# EAGLE design teensy3.5dds (EAGLE 9.6.2)
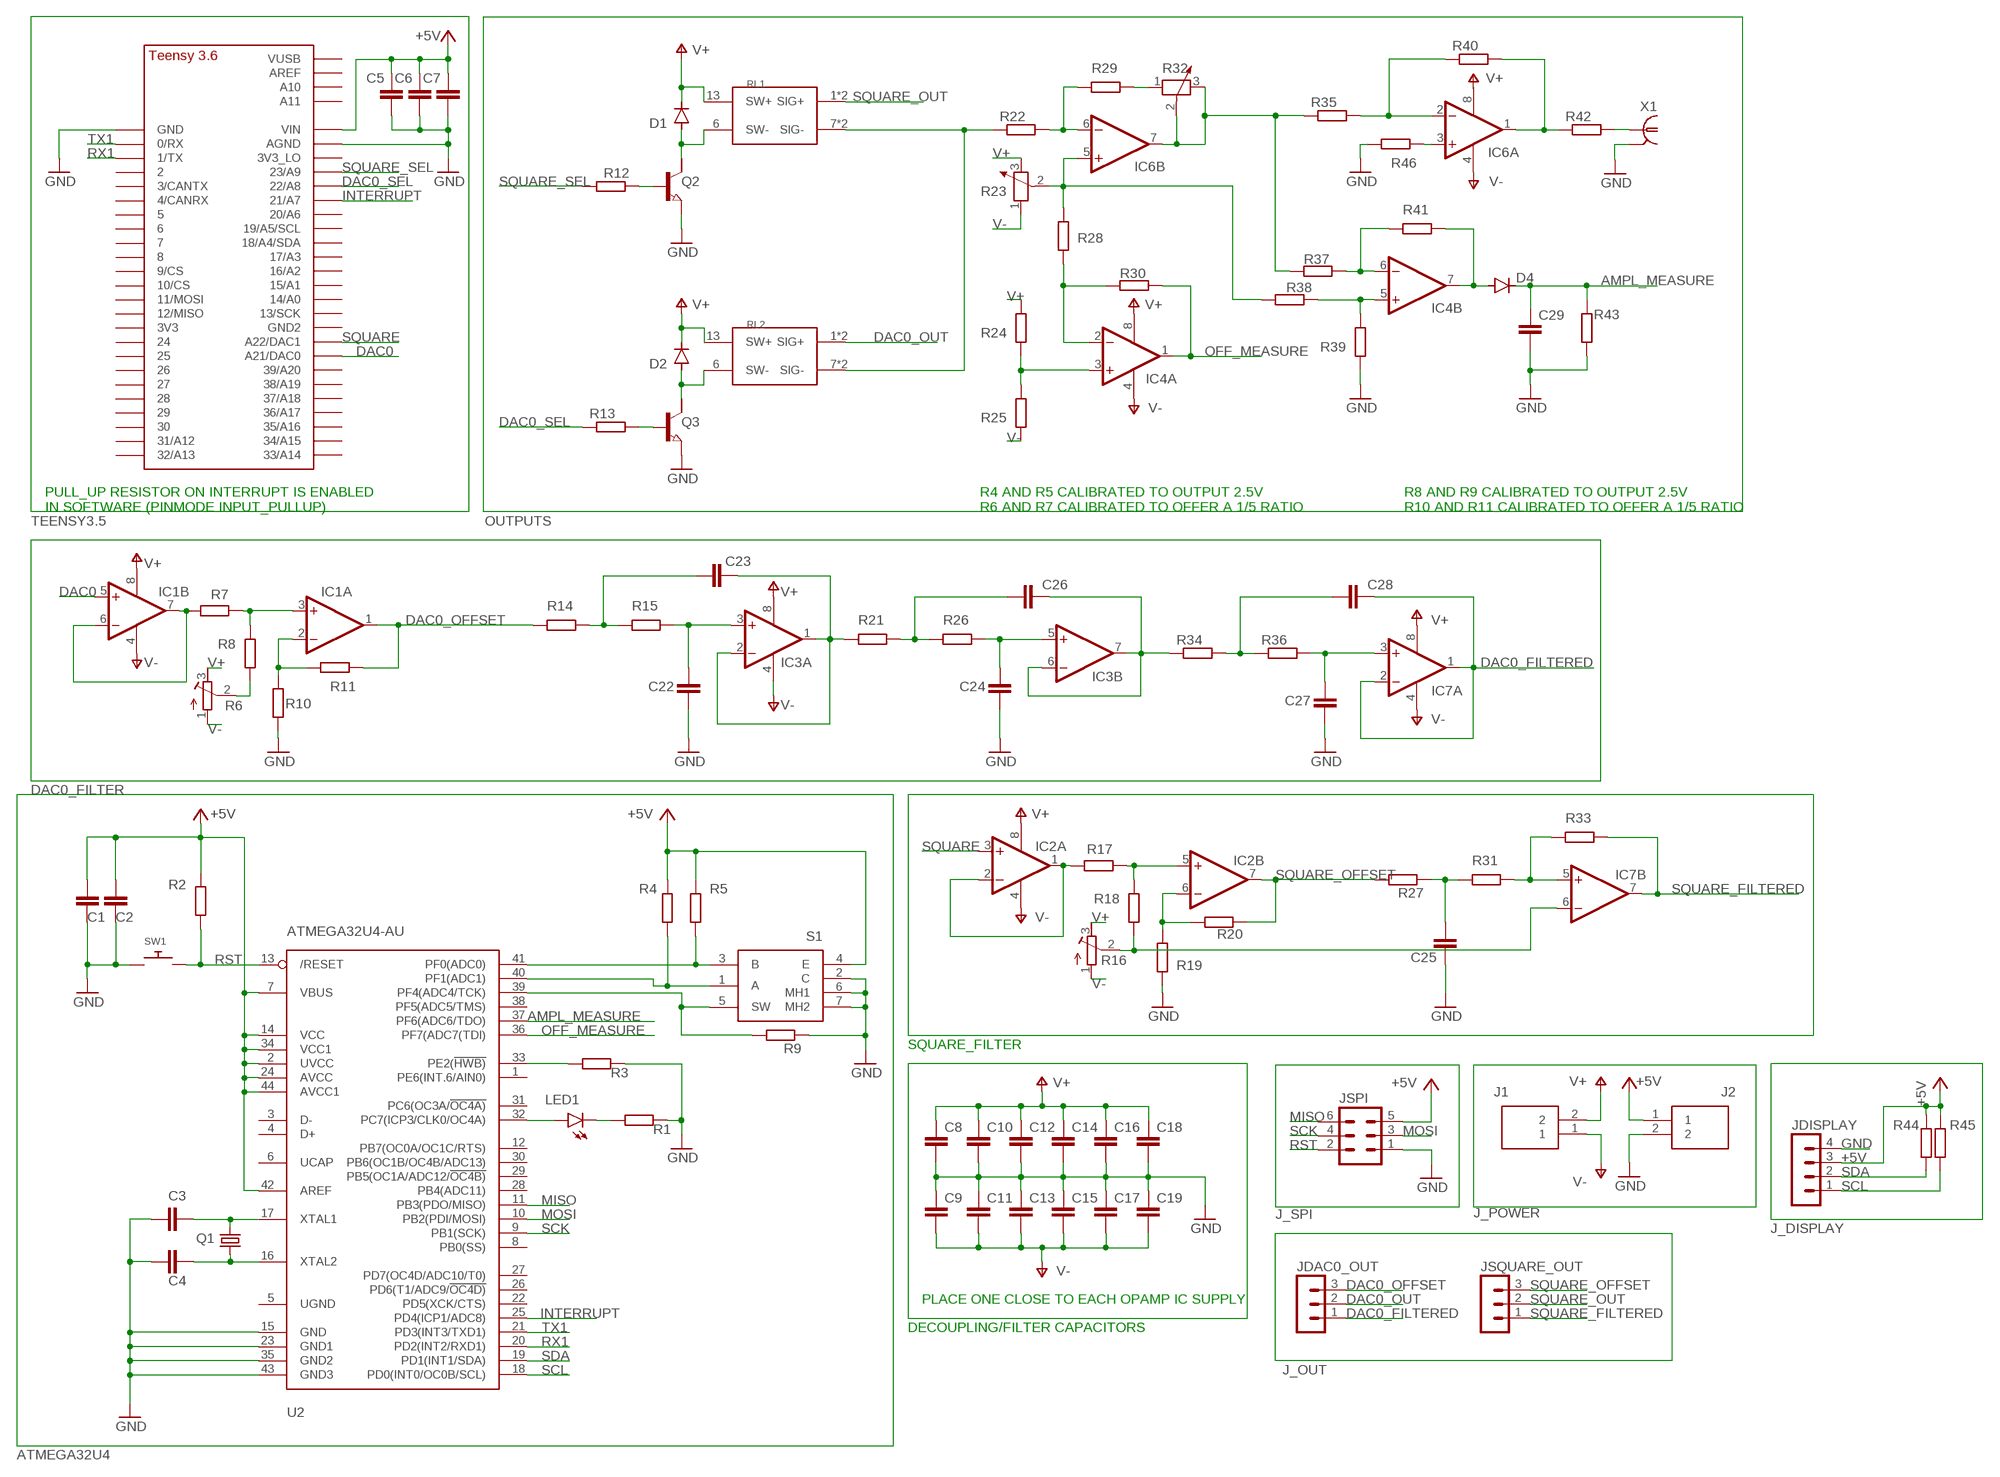
[diagram p0: schematic, sheet 1]

## Parts
C1  100u  C-EUC1206  [C1206]
C2  100n  C-EUC0805  [C0805]
C3  22p  C-EUC0805  [C0805]
C4  22p  C-EUC0805  [C0805]
C5  100u  C-EUC1206  [C1206]
C6  100n  C-EUC0805  [C0805]
C7  100n  C-EUC0805  [C0805]
C8  100n  C-EUC0805  [C0805]
C9  100n  C-EUC0805  [C0805]
C10  100n  C-EUC0805  [C0805]
C11  100n  C-EUC0805  [C0805]
C12  100n  C-EUC0805  [C0805]
C13  100n  C-EUC0805  [C0805]
C14  100n  C-EUC0805  [C0805]
C15  100n  C-EUC0805  [C0805]
C16  100n  C-EUC0805  [C0805]
C17  100n  C-EUC0805  [C0805]
C18  100n  C-EUC0805  [C0805]
C19  100n  C-EUC0805  [C0805]
C22  10p  C-EUC0805  [C0805]
C23  150p  C-EUC0805  [C0805]
C24  10p  C-EUC0805  [C0805]
C25  1p  C-EUC0805  [C0805]
C26  100p  C-EUC0805  [C0805]
C27  10p  C-EUC0805  [C0805]
C28  100p  C-EUC0805  [C0805]
C29  C-EUC0805  [C0805]
D1  DIODE-SOD323-W  [SOD323-W]
D2  DIODE-SOD323-W  [SOD323-W]
D4  DIODE-SOD123  [SOD123]
IC1  AD8034  TL082D  [SO08]
IC2  AD8034  TL082D  [SO08]
IC3  AD8034  TL082D  [SO08]
IC4  AD8034  TL082D  [SO08]
IC6  AD8034  TL082D  [SO08]
IC7  AD8034  TL082D  [SO08]
J1  1776275-2  [17762752]
J2  1776275-2  [17762752]
JDAC0_OUT  MA03-1  [MA03-1]
JDISPLAY  MA04-1  [MA04-1]
JSPI  MA03-2  [MA03-2]
JSQUARE_OUT  MA03-1  [MA03-1]
LED1  LEDCHIPLED_1206  [CHIPLED_1206]
Q1  16MHz  CSM-7X-DU  [CSM-7X-DU]
Q2  NPN-TRANSISTIOR-2COLSOT89  [SOT89]
Q3  NPN-TRANSISTIOR-2COLSOT89  [SOT89]
R1  220  R-EU_R0805  [R0805]
R2  10k  R-EU_R0805  [R0805]
R3  10k  R-EU_M0805  [M0805]
R4  10k  R-EU_R0805  [R0805]
R5  10k  R-EU_R0805  [R0805]
R6  100k  R-TRIMM3296W  [RTRIM3296W]
R7  1k  R-EU_R0805  [R0805]
R8  1k  R-EU_R0805  [R0805]
R9  10k  R-EU_R0805  [R0805]
R10  1k  R-EU_R0805  [R0805]
R11  1k  R-EU_R0805  [R0805]
R12  500  R-EU_R0805  [R0805]
R13  500  R-EU_R0805  [R0805]
R14  2.74k  R-EU_R0805  [R0805]
R15  2.74k  R-EU_R0805  [R0805]
R16  100k  R-TRIMM3296W  [RTRIM3296W]
R17  1k  R-EU_R0805  [R0805]
R18  1k  R-EU_R0805  [R0805]
R19  1k  R-EU_R0805  [R0805]
R20  1k  R-EU_R0805  [R0805]
R21  787  R-EU_R0805  [R0805]
R22  1k  R-EU_R0805  [R0805]
R23  10k  POTENTIOMETER_VERTICAL  [MA03-1]
R24  1k  R-EU_R0805  [R0805]
R25  1.5k  R-EU_R0805  [R0805]
R26  14.3k  R-EU_R0805  [R0805]
R27  50  R-EU_R0805  [R0805]
R28  5k  R-EU_R0805  [R0805]
R29  100  R-EU_R0805  [R0805]
R30  1k  R-EU_R0805  [R0805]
R31  2k  R-EU_R0805  [R0805]
R32  10k  POTENTIOMETER_VERTICAL  [MA03-1]
R33  10k  R-EU_R0805  [R0805]
R34  562  R-EU_R0805  [R0805]
R35  R-EU_R0805  [R0805]
R36  20k  R-EU_R0805  [R0805]
R37  5k  R-EU_R0805  [R0805]
R38  10k  R-EU_R0805  [R0805]
R39  14.3k  R-EU_R0805  [R0805]
R40  R-EU_R0805  [R0805]
R41  1k  R-EU_R0805  [R0805]
R42  50  R-EU_R0805  [R0805]
R43  R-EU_R0805  [R0805]
R44  R-EU_R0805  [R0805]
R45  R-EU_R0805  [R0805]
R46  R-EU_R0805  [R0805]
RL1  PRME_15005NOSOCKET  [DIL14]
RL2  PRME_15005NOSOCKET  [DIL14]
S1  EC11B15242AE  [EC11B15242AE]
SW1  SWITCH_PUSHBUTTONC&K_KSS  [BTN_CK_KSS]
U1  TEENSY_3.5/3.6_BASIC  [TEENSY_3.5/3.6_BASIC]
U2  ATMEGA32U4-AU  [TQFP44]
X1  1-227161-0  [AMP_227161]

## Nets
+5V [supply]: C1.1 C2.1 C5.1 C6.1 C7.1 J2.1 JDISPLAY.3 JSPI.5 R2.2 R4.1 R5.1 R44.2 R45.1 S1.4(E) U1.VIN U2.2(UVCC) U2.7(VBUS) U2.14(VCC) U2.24(AVCC) U2.34(VCC1) U2.42(AREF) U2.44(AVCC1)
AMPL_MEASURE [signal]: C29.1 D4.C R43.2 U2.37(PF6(ADC6/TDO))
DAC0 [signal]: IC1.5(B:+IN) U1.21/DAC0(A21/DAC0)
DAC0_FILTERED [signal]: C28.1 IC7.1(A:OUT) IC7.2(A:-IN) JDAC0_OUT.1
DAC0_OFFSET [signal]: IC1.1(A:OUT) JDAC0_OUT.3 R11.1 R14.1
DAC0_OUT [signal]: JDAC0_OUT.2 RL2.1(SIG+) RL2.14(SIG+)
DAC0_SEL [signal]: R13.1 U1.22/A8
GND [supply]: C1.2 C2.2 C3.1 C4.1 C5.2 C6.2 C7.2 C8.2 C9.1 C10.2 C11.1 C12.2 C13.1 C14.2 C15.1 C16.2 C17.1 C18.2 C19.1 C22.1 C24.1 C25.1 C27.1 C29.2 J2.2 JDISPLAY.4 JSPI.1 Q2.3(E) Q3.3(E) R1.1 R3.2 R9.1 R10.2 R19.2 R39.2 R43.1 R46.1 S1.2(C) S1.6(MH1) S1.7(MH2) SW1.P$1 U1.AGND U1.GND U2.15(GND) U2.23(GND1) U2.35(GND2) U2.43(GND3) X1.2
INTERRUPT [signal]: U1.21/A7 U2.25(PD4(ICP1/ADC8))
MISO [signal]: JSPI.6 U2.11(PB3(PDO/MISO))
MOSI [signal]: JSPI.3 U2.10(PB2(PDI/MOSI))
N$1 [signal]: IC7.5(B:+IN) R31.2 R33.1
N$2 [signal]: D1.A Q2.2(C) RL1.6(SW-)
N$3 [signal]: IC6.5(B:+IN) R23.2 R28.1 R38.1
N$4 [signal]: C4.2 Q1.1 U2.16(XTAL2)
N$5 [signal]: IC6.6(B:-IN) R22.2 R29.1
N$6 [signal]: R42.2 X1.1
N$8 [signal]: R5.2 S1.3(B) U2.41(PF0(ADC0))
N$9 [signal]: IC6.7(B:OUT) R32.2 R32.3 R35.1 R37.1
N$10 [signal]: R22.1 RL1.7(SIG-) RL1.8(SIG-) RL2.7(SIG-) RL2.8(SIG-)
N$11 [signal]: IC4.2(A:-IN) R28.2 R30.2
N$12 [signal]: D2.A Q3.2(C) RL2.6(SW-)
N$13 [signal]: IC4.3(A:+IN) R24.1 R25.2
N$14 [signal]: IC4.5(B:+IN) R38.2 R39.1
N$15 [signal]: R29.2 R32.1
N$16 [signal]: IC4.6(B:-IN) R37.2 R41.1
N$17 [signal]: Q2.1(B) R12.2
N$18 [signal]: Q3.1(B) R13.2
N$19 [signal]: IC6.1(A:OUT) R40.2 R42.1
N$20 [signal]: D4.A IC4.7(B:OUT) R41.2
N$21 [signal]: IC1.2(A:-IN) R10.1 R11.2
N$22 [signal]: IC6.3(A:+IN) R46.2
N$23 [signal]: IC1.6(B:-IN) IC1.7(B:OUT) R7.1
N$24 [signal]: IC2.6(B:-IN) R19.1 R20.2
N$25 [signal]: R4.2 S1.1(A) U2.40(PF1(ADC1))
N$26 [signal]: IC1.3(A:+IN) R7.2 R8.2
N$27 [signal]: IC2.1(A:OUT) IC2.2(A:-IN) R17.1
N$28 [signal]: IC2.5(B:+IN) R17.2 R18.2
N$29 [signal]: R9.2 S1.5(SW) U2.39(PF4(ADC4/TCK))
N$30: LED1.A U2.32(PC7(ICP3/CLK0/OC4A))
N$31 [signal]: C3.2 Q1.2 U2.17(XTAL1)
N$32 [signal]: R3.1 U2.33(PE2(!HWB))
N$34 [signal]: C25.2 R27.1 R31.1
N$36 [signal]: IC6.2(A:-IN) R35.2 R40.1
N$37 [signal]: IC7.6(B:-IN) R16.2(S) R18.1
N$38 [signal]: LED1.C R1.2
N$50 [signal]: C23.2 R14.2 R15.1
N$53 [signal]: C23.1 IC3.1(A:OUT) IC3.2(A:-IN) R21.1
N$56 [signal]: R6.2(S) R8.1
N$58 [signal]: C22.2 IC3.3(A:+IN) R15.2
N$61 [signal]: C26.1 R21.2 R26.1
N$62 [signal]: C26.2 IC3.6(B:-IN) IC3.7(B:OUT) R34.1
N$63 [signal]: C24.2 IC3.5(B:+IN) R26.2
N$73 [signal]: C28.2 R34.2 R36.1
N$75 [signal]: C27.2 IC7.3(A:+IN) R36.2
OFF_MEASURE [signal]: IC4.1(A:OUT) R30.1 U2.36(PF7(ADC7(TDI))
RST [signal]: JSPI.2 R2.1 SW1.P$2 U2.13(/RESET)
RX1 [signal]: U1.1/TX U2.20(PD2(INT2/RXD1))
SCK [signal]: JSPI.4 U2.9(PB1(SCK))
SCL [signal]: JDISPLAY.1 R45.2 U2.18(PD0(INT0/OC0B/SCL))
SDA [signal]: JDISPLAY.2 R44.1 U2.19(PD1(INT1/SDA))
SQUARE [signal]: IC2.3(A:+IN) U1.A22/DAC1
SQUARE_FILTERED [signal]: IC7.7(B:OUT) JSQUARE_OUT.1 R33.2
SQUARE_OFFSET [signal]: IC2.7(B:OUT) JSQUARE_OUT.3 R20.1 R27.2
SQUARE_OUT [signal]: JSQUARE_OUT.2 RL1.1(SIG+) RL1.14(SIG+)
SQUARE_SEL [signal]: R12.1 U1.23/A9
TX1 [signal]: U1.0/RX U2.21(PD3(INT3/TXD1))
V+ [supply]: C8.1 C10.1 C12.1 C14.1 C16.1 C18.1 D1.C D2.C IC1.8(P:V+) IC2.8(P:V+) IC3.8(P:V+) IC4.8(P:V+) IC6.8(P:V+) IC7.8(P:V+) J1.2 R6.3(E) R16.3(E) R23.3 R24.2 RL1.13(SW+) RL2.13(SW+)
V- [supply]: C9.2 C11.2 C13.2 C15.2 C17.2 C19.2 IC1.4(P:V-) IC2.4(P:V-) IC3.4(P:V-) IC4.4(P:V-) IC6.4(P:V-) IC7.4(P:V-) J1.1 R6.1(A) R16.1(A) R23.1 R25.1
Unconnected: Q2.2@1(C/) Q3.2@1(C/) U1.2 U1.3/CANTX U1.3V3 U1.3V3_LO U1.4/CANRX U1.5 U1.6 U1.7 U1.8 U1.9/CS U1.10/CS U1.11/MOSI U1.12/MISO U1.13/SCK U1.14/A0 U1.15/A1 U1.16/A2 U1.17/A3 U1.18/A4/SDA U1.19/A5/SCL U1.20/A6 U1.24 U1.25 U1.26 U1.27 U1.28 U1.29 U1.30 U1.31/A12 U1.32/A13 U1.33/A14 U1.34/A15 U1.35/A16 U1.36/A17 U1.37/A18 U1.38/A19 U1.39/A20 U1.A10 U1.A11 U1.AREF U1.GND2 U1.VUSB U2.1(PE6(INT.6/AIN0)) U2.3(D-) U2.4(D+) U2.5(UGND) U2.6(UCAP) U2.8(PB0(SS)) U2.12(PB7(OC0A/OC1C/RTS)) U2.22(PD5(XCK/CTS)) U2.26(PD6(T1/ADC9/!OC4D)) U2.27(PD7(OC4D/ADC10/T0)) U2.28(PB4(ADC11)) U2.29(PB5(OC1A/ADC12/!OC4B)) U2.30(PB6(OC1B/OC4B/ADC13)) U2.31(PC6(OC3A/!OC4A)) U2.38(PF5(ADC5/TMS))

## Notes on the sheet
- PULL_UP RESISTOR ON INTERRUPT IS ENABLED
  IN SOFTWARE (PINMODE INPUT_PULLUP)
- R4 AND R5 CALIBRATED TO OUTPUT 2.5V
  R6 AND R7 CALIBRATED TO OFFER A 1/5 RATIO
- R8 AND R9 CALIBRATED TO OUTPUT 2.5V
  R10 AND R11 CALIBRATED TO OFFER A 1/5 RATIO
- SQUARE_FILTER
- PLACE ONE CLOSE TO EACH OPAMP IC SUPPLY
- DECOUPLING/FILTER CAPACITORS

## Library data of the parts
C1-C19 C22-C29 = rcl:C-EU: CAPACITOR, European symbol; SPICEPREFIX: C
D1 D2 D4 = diode:DIODE-: DIODE
IC1-IC4 IC6 IC7 = linear:TL082: OP AMP Data sheet <http://www.ti.com/lit/ds/symlink/tl084a . pdf>; DATA_SHEET: <a href="http://www.ti.com/lit/ds/symlink/tl084a.pdf"> Data sheet </a>
J1 J2 = 1776275-2:1776275-2: Fixed Terminal Blocks 2 POS SIDE ENT 3.5MM Source: Datasheet <https://www.mouser.co.uk/ProductDetail/TE-Connectivity-AMP/1776275-2/?qs=/ha2pyFaduh5oRLpYFqVQ2CuT224sRAAEtPMkKhfNDU=>; DESCRIPTION: Fixed Terminal Blocks 2 POS SIDE ENT 3.5MM; HEIGHT: 8.6mm; MANUFACTURER_NAME: TE Connectivity; MANUFACTURER_PART_NUMBER: 1776275-2
JDAC0_OUT JSQUARE_OUT = con-lstb:MA03-1: PIN HEADER; OC_FARNELL: unknown; OC_NEWARK: unknown
JDISPLAY = con-lstb:MA04-1: PIN HEADER; OC_FARNELL: unknown; OC_NEWARK: unknown
JSPI = con-lstb:MA03-2: PIN HEADER; OC_FARNELL: unknown; OC_NEWARK: unknown
LED1 = led:LED: LED OSRAM: - CHIPLED LG R971, LG N971, LY N971, LG Q971, LY Q971, LO R971, LY R971 LH N974, LH R974 LS Q976, LO Q976, LY Q976 LO Q996 - Hyper CHIPLED LW Q18S LB Q993, LB Q99A, LB R99A - SideLED LS A670, LO A670, LY A670, LG A670, LP A670 LB A673, LV A673, LT A673, LW A673 LH A674 LY A675 LS A676, LA A676, LO A676, LY A676, LW A676 LS A679, LY A679, LG A679 - Hyper Micro SIDELED® LS Y876, LA Y876, LO Y876, LY Y876 LT Y87S - SmartLED LW L88C, LW L88S LB L89C, LB L89S, LG L890 LS L89K, LO L89K, LY L89K LS L896, LA L896, LO L896, LY L896 - TOPLED LS T670, LO T670, LY T670, LG T670, LP T670 LSG T670, LSP T670, LSY T670, LOP T670, LYG T670 LG T671, LOG T671, LSG T671 LB T673, LV T673, LT T673, LW T673 LH T674 LS T676, LA T676, LO T676, LY T676, LB T676, LH T676, LSB T676, LW T676 LB T67C, LV T67C, LT T67C, LS T67K, LO T67K, LY T67K, LW E67C LS E67B, LA E67B, LO E67B, LY E67B, LB E67C, LV E67C, LT E67C LW T67C LS T679, LY T679, LG T679 LS T770, LO T770, LY T770, LG T770, LP T770 LB T773, LV T773, LT T773, LW T773 LH T774 LS E675, LA E675, LY E675, LS T675 LS T776, LA T776, LO T776, LY T776, LB T776 LHGB T686 LT T68C, LB T68C - Hyper Mini TOPLED® LB M676 - Mini TOPLED Santana® LG M470 LS M47K, LO M47K, LY M47K Source: http://www.osram.convergy.de LUXEON: - LUMILED® LXK2-PW12-R00, LXK2-PW12-S00, LXK2-PW14-U00, LXK2-PW14-V00 LXK2-PM12-R00, LXK2-PM12-S00, LXK2-PM14-U00 LXK2-PE12-Q00, LXK2-PE12-R00, LXK2-PE12-S00, LXK2-PE14-T00, LXK2-PE14-U00 LXK2-PB12-K00, LXK2-PB12-L00, LXK2-PB12-M00, LXK2-PB14-N00, LXK2-PB14-P00, LXK2-PB14-Q00 LXK2-PR12-L00, LXK2-PR12-M00, LXK2-PR14-Q00, LXK2-PR14-R00 LXK2-PD12-Q00, LXK2-PD12-R00, LXK2-PD12-S00 LXK2-PH12-R00, LXK2-PH12-S00 LXK2-PL12-P00, LXK2-PL12-Q00, LXK2-PL12-R00 Source: www.luxeon.com KINGBRIGHT: KA-3528ASYC Source: www.kingbright.com
Q1 = crystal:CSM-7X-DU: SMD CRYSTAL Source: www.ecsxtal.com .. Crystal 3.6864MHz CSM_7X_DU.PDF; OC_FARNELL: unknown; OC_NEWARK: unknown
Q2 Q3 = semicon-smd-ipc:NPN-TRANSISTIOR-2COL: NPN TRANSISTOR 2 colletor pins
R1-R5 R7-R15 R17-R22 R24-R31 R33-R46 = rcl:R-EU_: RESISTOR, European symbol; SPICEPREFIX: R
R6 R16 = rcl:R-TRIMM: Trimm resistor; SPICEMODEL: X; SPICEPREFIXL: POT
R23 R32 = Potentiometer_vertical:POTENTIOMETER_VERTICAL
RL1 RL2 = prme15005:PRME_15005
S1 = EC11B15242AE:EC11B15242AE: 20mm Horizontal encoder 15 Pulses 30 DET Source: Datasheet <https://www.alps.com/prod/info/E/HTML/Encoder/Incremental/EC11/EC11B15242AE.html#Dimensions>; DESCRIPTION: 20mm Horizontal encoder 15 Pulses 30 DET; HEIGHT: 13mm; MANUFACTURER_NAME: ALPS; MANUFACTURER_PART_NUMBER: EC11B15242AE; MOUSER_PART_NUMBER: 688-EC11B15242AE; MOUSER_PRICE-STOCK: http://www.mouser.com/Search/ProductDetail.aspx?qs=PoKhxlfUXjIm2pRMScFQOQ%3d%3d
SW1 = adafruit:SWITCH_PUSHBUTTON: Buttons SOFTTOUCHSMD_SJ - Soft touch temporary push button (Super Junk Akihabara) Compatible with SKPMANE010 [Mouser: 688-SKPMAN] C&K_KSS = Digikey: KSS221GLFS
U1 = Teensy356:TEENSY_3.5/3.6_BASIC
U2 = adafruit:ATMEGA32U4: http://www.ladyada.net/library/eagle
X1 = con-coax:?227161*: JACK, RIGHT ANGLE, 50 OHM, PCB, BNC Source: amp_227161.pdf; MF: TYCO ELECTRONICS; MPN: 1-227161; OC_FARNELL: unknown; OC_NEWARK: 33B3200

## Net classes
0 default: width 0.254 mm
1 signal: width 0.254 mm
2 supply: width 0.381 mm

## Board
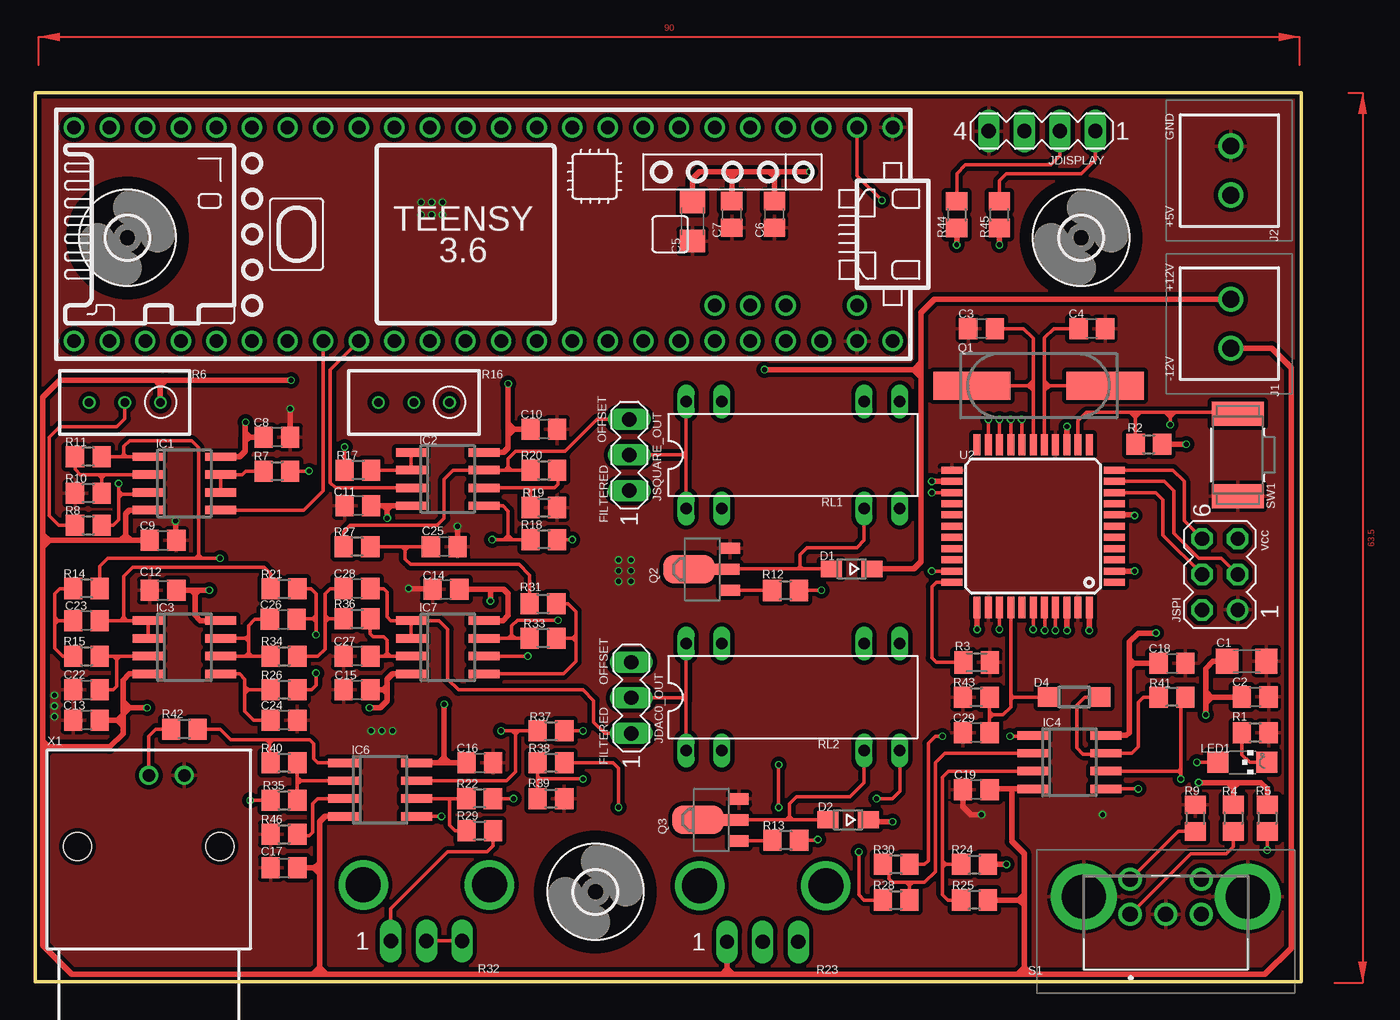
[diagram p1: board, top side]
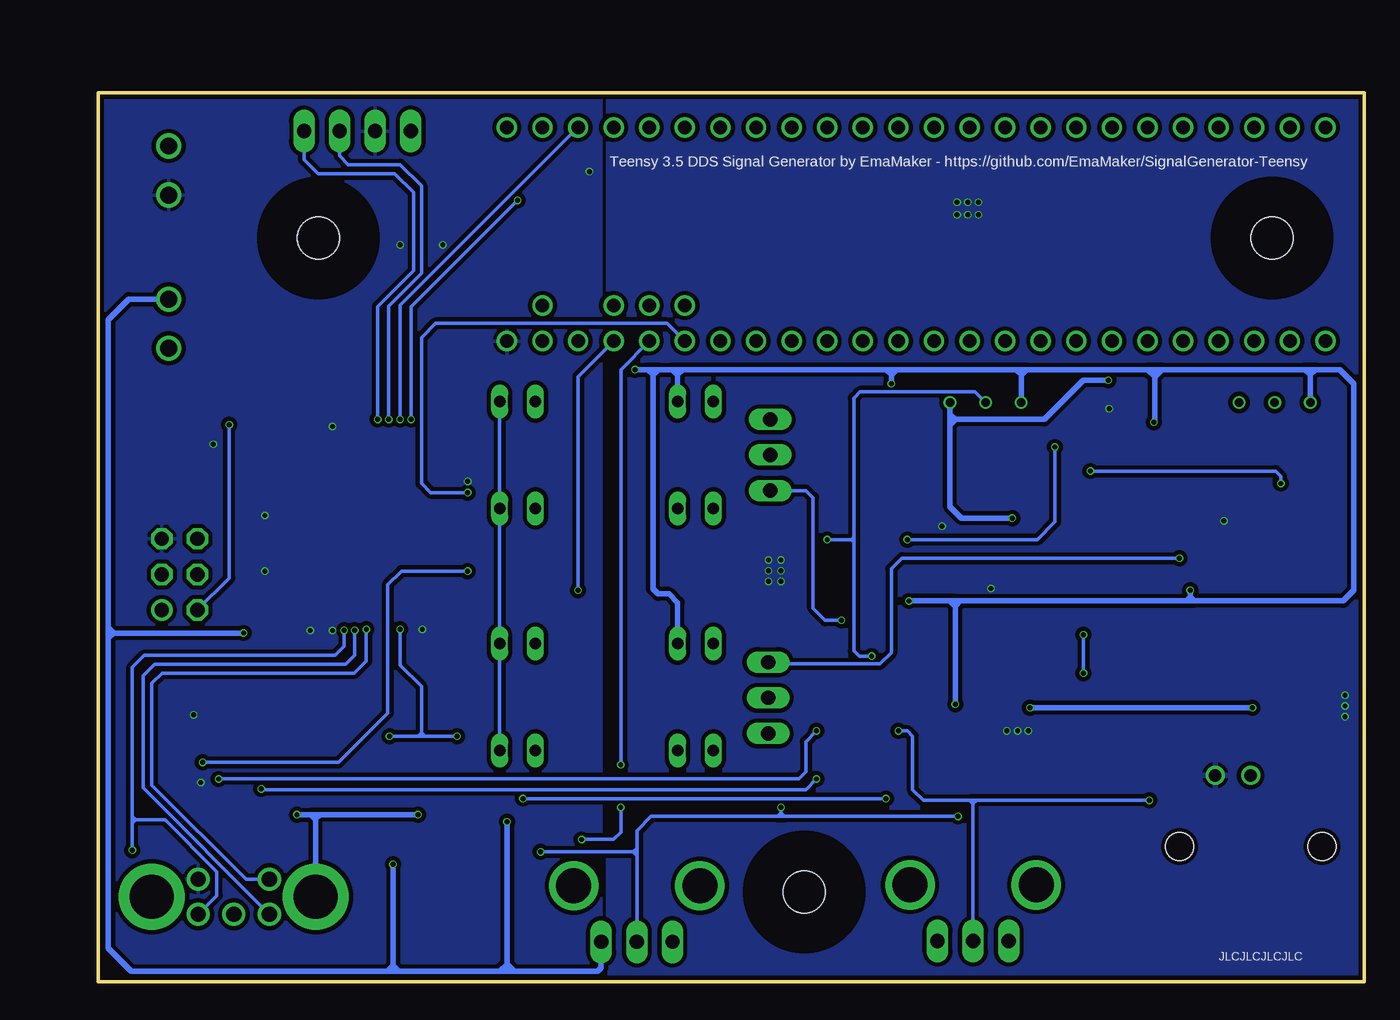
[diagram p2: board, bottom side, seen from below]

Size 90.38 x 63.42 mm. Coordinates in mm from the lower left corner, seen from the top.
Outline: 0,0 90.38,0 90.38,63.42 0,63.42 0,0
Copper layers (1*16): Top 0.035559375mm / dielectric 1.6mm / Bottom 0.035559375mm
Design rules "jlcpcb2layer": minimum track width 5mil, minimum drill 12mil, track to track 5mil, track to pad 5mil, pad to pad 5mil, via to via 5mil, smd to smd 5mil, copper to edge 8mil, drill to drill 6mil, minimum pad ring 5mil, minimum via ring 3mil, stop-mask expansion 2.5mil, vias tented up to drill 0mil, thermal gap 10mil

### Footprints (pad centres in the part's own frame; a part is rotated, then mirrored left to right if it is on the bottom)
C1206 = smd 1.6 x 1.8: 1 -1.4,0; 2 1.4,0
C0805 = smd 1.3 x 1.5: 1 -0.95,0; 2 0.95,0
SOD323-W = smd 1.5 x 1.2: A 1.45,0; C -1.45,0
SOD123 = smd 1.4 x 1.4: A 1.9,0; C -1.9,0
SO08 = smd 0.6 x 2.2: 1 -1.905,-2.6; 2 -0.635,-2.6; 3 0.635,-2.6; 4 1.905,-2.6; 5 1.905,2.6; 6 0.635,2.6; 7 -0.635,2.6; 8 -1.905,2.6
17762752 = drill 1.2 pad 1.8: 1 0,0; 2 3.5,0
MA03-1 = drill 1.016 long: 1 -2.54,0; 2 0,0; 3 2.54,0
MA04-1 = drill 1.016 long: 1 -3.81,0; 2 -1.27,0; 3 1.27,0; 4 3.81,0
MA03-2 = drill 1.016: 1 -2.54,-1.27 | drill 1.016 octagon: 2 -2.54,1.27; 3 0,-1.27; 4 0,1.27; 5 2.54,-1.27; 6 2.54,1.27
CHIPLED_1206 = smd 1.5 x 1.5: A 0,-1.75; C 0,1.75
CSM-7X-DU = smd 5.5 x 2: 1 -4.75,0; 2 4.75,0
SOT89 = smd 0.8 x 1.4: 1 -1.499,-1.981; 3 1.499,-1.981 | smd 0.8 x 1.9: 2 0,-1.727 | smd 2.032 x 3.65: 2@1 0,0.94
R0805 = smd 1.3 x 1.5: 1 -0.95,0; 2 0.95,0
M0805 = smd 1.3 x 1.6: 1 -0.95,0; 2 0.95,0
RTRIM3296W = drill 0.61: 1 0,-2.54; 2 0,0; 3 0,2.54
MA03-1' = drill 1.016 long: 1 -2.54,0; 2 0,0; 3 2.54,0 | drill 2.5 pad 3: P$1 4.5,4; P$2 -4.5,4
DIL14 = drill 0.813 long: 1 -7.62,-3.81; 2 -5.08,-3.81; 6 5.08,-3.81; 7 7.62,-3.81; 8 7.62,3.81; 9 5.08,3.81; 13 -5.08,3.81; 14 -7.62,3.81
EC11B15242AE = drill 1.1 pad 1.65: 1 -0.95,-2.54; 2 -0.95,0; 3 -0.95,2.54; 4 -3.45,2.54; 5 -3.45,-2.54 | drill 3.14 pad 4.71: 6 -2.2,5.85; 7 -2.2,-5.85
BTN_CK_KSS = smd 1.7 x 3.7: P$1 -2.95,0; P$2 2.95,0
TEENSY_3.5/3.6_BASIC = drill 0.965: 0/RX -25.4,-7.62; 1/TX -22.86,-7.62; 2 -20.32,-7.62; 3/CANTX -17.78,-7.62; 3V3 7.62,-7.62; 3V3_LO -22.86,7.62; 4/CANRX -15.24,-7.62; 5 -12.7,-7.62; 6 -10.16,-7.62; 7 -7.62,-7.62; 8 -5.08,-7.62; 9/CS -2.54,-7.62; 10/CS 0,-7.62; 11/MOSI 2.54,-7.62; 12/MISO 5.08,-7.62; 13/SCK 5.08,7.62; 14/A0 2.54,7.62; 15/A1 0,7.62; 16/A2 -2.54,7.62; 17/A3 -5.08,7.62; 18/A4/SDA -7.62,7.62; 19/A5/SCL -10.16,7.62; 20/A6 -12.7,7.62; 21/A7 -15.24,7.62; 21/DAC0 12.7,7.62; 22/A8 -17.78,7.62; 23/A9 -20.32,7.62; 24 10.16,-7.62; 25 12.7,-7.62; 26 15.24,-7.62; 27 17.78,-7.62; 28 20.32,-7.62; 29 22.86,-7.62; 30 25.4,-7.62; 31/A12 27.94,-7.62; 32/A13 30.48,-7.62; 33/A14 30.48,7.62; 34/A15 27.94,7.62; 35/A16 25.4,7.62; 36/A17 22.86,7.62; 37/A18 20.32,7.62; 38/A19 17.78,7.62; 39/A20 15.24,7.62; A10 -17.78,5.08; A11 -15.24,5.08; A22/DAC1 10.16,7.62; AGND -25.4,7.62; AREF -20.32,5.08; GND -27.94,-7.62; GND2 7.62,7.62; VIN -27.94,7.62; VUSB -25.4,5.08
TQFP44 = smd 1.5 x 0.5: 1 -5.8,4; 2 -5.8,3.2; 3 -5.8,2.4; 4 -5.8,1.6; 5 -5.8,0.8; 6 -5.8,0; 7 -5.8,-0.8; 8 -5.8,-1.6; 9 -5.8,-2.4; 10 -5.8,-3.2; 11 -5.8,-4; 23 5.8,-4; 24 5.8,-3.2; 25 5.8,-2.4; 26 5.8,-1.6; 27 5.8,-0.8; 28 5.8,0; 29 5.8,0.8; 30 5.8,1.6; 31 5.8,2.4; 32 5.8,3.2; 33 5.8,4 | smd 0.5 x 1.5: 12 -4,-5.8; 13 -3.2,-5.8; 14 -2.4,-5.8; 15 -1.6,-5.8; 16 -0.8,-5.8; 17 0,-5.8; 18 0.8,-5.8; 19 1.6,-5.8; 20 2.4,-5.8; 21 3.2,-5.8; 22 4,-5.8; 34 4,5.8; 35 3.2,5.8; 36 2.4,5.8; 37 1.6,5.8; 38 0.8,5.8; 39 0,5.8; 40 -0.8,5.8; 41 -1.6,5.8; 42 -2.4,5.8; 43 -3.2,5.8; 44 -4,5.8
3,0 = hole 3: 0,0
AMP_227161 = drill 0.9 pad 1.27: 1 0,-5.08; 2 -2.54,-5.08 | hole 2: -5.08,0; 5.08,0

### Placement (x,y rotation side)
C1  86.48,22.88 0 top
C2  87.09,20.32 0 top
C3  67.56,46.6 0 top
C4  75.43,46.6 180 top
C5  46.93,54.25 270 top
C6  52.77,54.76 270 top
C7  49.73,54.76 270 top
C8  17.26,38.86 0 top
C9  9.14,31.49 180 top
C10  36.31,39.43 0 top
C11  23.04,33.97 0 top
C12  9.14,27.93 180 top
C13  3.67,18.66 0 top
C14  29.33,28 180 top
C15  22.98,20.82 0 top
C16  31.74,15.62 0 top
C17  17.77,8.12 0 top
C18  81.15,22.73 0 top
C19  67.18,13.71 0 top
C22  3.67,20.82 0 top
C23  3.67,25.77 180 top
C24  17.77,18.66 180 top
C25  29.2,31.05 180 top
C26  17.72,25.85 180 top
C27  22.98,23.23 0 top
C28  22.98,28.06 180 top
C29  67.18,17.77 180 top
D1  58.28,29.46 180 top
D2  58.03,11.55 180 top
D4  74.16,20.31 0 top
IC1  10.66,35.55 270 top
IC2  29.46,35.87 270 top
IC3  10.66,23.87 270 top
IC4  73.83,15.67 270 top
IC6  24.63,13.71 270 top
IC7  29.46,23.87 270 top
J1  85.34,45.21 90 top
J2  85.34,56.13 90 top
JDAC0_OUT  42.56,20.26 90 top
JDISPLAY  71.87,60.7 180 top
JSPI  84.57,29.07 90 top
JSQUARE_OUT  42.41,37.59 90 top
LED1  86.17,15.65 270 top
Q1  71.62,42.54 180 top
Q2  47.62,29.43 90 top
Q3  48.25,11.55 90 top
R1  87.09,17.78 180 top
R2  79.49,38.35 0 top
R3  67.21,22.78 0 top
R4  85.53,11.68 270 top
R5  87.94,11.68 270 top
R6  6.41,41.33 90 top
R7  17.26,36.44 0 top
R8  3.8,32.57 0 top
R9  82.8,11.68 270 top
R10  3.8,34.86 180 top
R11  3.8,37.46 180 top
R12  53.57,27.92 180 top
R13  53.59,10.09 180 top
R14  3.67,28.06 180 top
R15  3.67,23.23 0 top
R16  27.04,41.33 90 top
R17  23.04,36.51 180 top
R18  36.31,31.55 180 top
R19  36.31,33.84 0 top
R20  36.31,36.51 0 top
R21  17.77,28.04 0 top
R22  31.73,13.07 180 top
R23  10k  [MA03-1']  51.93,2.85 0 top
R24  67.05,8.38 0 top
R25  67.05,5.84 180 top
R26  17.77,20.82 180 top
R27  22.98,31.05 180 top
R28  61.46,5.84 0 top
R29  31.74,10.79 0 top
R30  61.46,8.38 180 top
R31  36.25,26.98 0 top
R32  10k  [MA03-1']  27.93,2.91 0 top
R33  36.25,24.51 180 top
R34  17.77,23.23 0 top
R35  17.77,12.95 0 top
R36  22.98,25.9 0 top
R37  36.82,17.9 0 top
R38  36.82,15.62 180 top
R39  36.82,13.07 0 top
R40  17.77,15.62 180 top
R41  81.15,20.31 180 top
R42  10.66,18.03 180 top
R43  67.18,20.31 0 top
R44  65.78,54.73 270 top
R45  68.83,54.73 90 top
R46  17.77,10.53 0 top
RL1  54.09,37.59 0 top
RL2  54.09,20.31 0 top
S1  80.7,3.87 270 top
SW1  85.84,37.59 90 top
U1  33.27,53.33 180 top
U2  71.24,32.51 180 top
U$1  [3,0]  40,6.42 0 top
U$3  [3,0]  6.6,53.08 0 top
U$4  [3,0]  74.67,53.08 0 top
X1  8.12,9.65 180 top

### Tracks (layer width: path | path; a pad name or v marks a point on that pad's centre or on a via)
+5V  (via drill 0.35)
  Top 0.381: U2.34 v67.24,25.14 | U2.42 73.65,26.69 v73.65,25.06 | U2.44 v75.24,25.06 | U2.14 73.64,39.6 v73.65,39.62 | U2.24 v64,35.71 | U2.7 78.44,33.31 v78.48,33.27 | U2.2 v78.48,29.31 | C5.1 46.93,57.3 47.44,57.8 49.34,57.8 | 49.34,57.8 49.72,57.8 | 49.72,57.8 50.11,57.8 | C7.1 49.72,57.42 | 49.72,57.8 49.72,57.42 | 49.72,57.42 50.11,57.8 | 49.72,57.42 49.34,57.8 | 50.11,57.8 52.39,57.8 | 52.39,57.8 52.77,57.8 | 52.77,57.8 53.03,57.8 | 53.03,57.8 v55.31,57.8 | C6.1 52.77,57.42 | 52.77,57.8 52.77,57.42 | 52.39,57.8 52.77,57.42 | 52.77,57.42 53.03,57.68 53.03,57.8 | R44.2 v65.78,52.57 | R45.1 v68.83,52.57 | C1.1 85.05,22.85 84.07,22.85 83.56,22.35 83.56,20.72 | 83.56,20.72 83.56,20.31 | 83.56,20.31 83.56,19.91 | v83.56,19.04 83.56,19.91 | C2.1 83.96,20.31 | 83.56,20.31 83.96,20.31 | 83.56,19.91 83.96,20.31 | 83.96,20.31 83.56,20.72 | R5.1 87.94,13.77 87.5,14.22 85.91,14.22 | 85.91,14.22 85.46,14.22 | 85.46,14.22 85.16,14.22 | 85.16,14.22 v83.05,14.22 | 85.46,14.22 85.53,14.15 85.53,13.84 | 85.91,14.22 85.53,13.84 | 85.53,13.84 85.16,14.2 85.16,14.22 | R2.2 v82.16,38.35 | R4.1 85.53,13.84
  pour Bottom (isolate 0.305): 91.18,64.13 54.47,64.13 54.47,-0.51 91.18,-0.51
AMPL_MEASURE
  Top 0.254: C29.1 68.12,18.79 | 68.12,18.79 68.12,19.04 | 68.12,19.04 68.12,19.3 | 68.12,19.3 R43.2 | U2.37 69.64,20.52 | 69.64,20.52 69.64,20.31 | 69.64,20.31 69.64,20.11 | 69.64,20.11 69.64,19.6 69.08,19.04 68.32,19.04 | 68.12,19.04 68.32,19.04 | 68.32,19.04 68.32,18.98 68.12,18.79 | 68.32,19.04 68.32,19.1 68.12,19.3 | 69.84,20.31 69.64,20.31 | 69.64,20.11 69.84,20.31 | 69.84,20.31 69.64,20.52 | 69.84,20.31 D4.C
DAC0
  Top 0.254: IC1.5 19.17,33.65 20.57,35.05 U1.21/DAC0
DAC0_FILTERED
  Top 0.254: IC7.2 IC7.1 | IC7.1 28.82,25.77 29.46,25.14 29.46,21.58 30.22,20.82 39.11,20.82 39.87,20.06 39.87,18.54 40.68,17.72 JDAC0_OUT.1 | C28.1 24.88,28.06 25.14,27.81 25.14,26.03 25.39,25.77 IC7.1
DAC0_OFFSET  (via drill 0.35)
  Top 0.254: IC1.1 6.54,37.46 | 6.54,37.46 6.34,37.46 | 6.34,37.46 6.14,37.46 | 6.14,37.46 R11.1 | R14.1 4.62,29.65 5.2,30.22 11.42,30.22 | 11.68,30.47 11.68,38.09 11.17,38.6 6.75,38.6 6.34,38.2 6.34,37.66 | 11.42,30.22 11.68,30.22 | 11.68,30.22 11.93,30.22 | 11.93,30.22 v13.2,30.22 | 11.93,30.22 11.68,30.47 | 11.68,30.47 11.68,30.22 | 11.68,30.47 11.42,30.22 | 6.34,37.66 6.34,37.46 | 6.34,37.66 6.54,37.46 | 6.34,37.66 6.14,37.46
  Bottom 0.254: v13.2,30.22 33.01,30.22 33.77,29.46 33.77,23.49 34.59,22.68 42.43,22.68 JDAC0_OUT.3
DAC0_OUT
  Top 0.254: JDAC0_OUT.2 46.22,20.26 | 46.47,20.26 46.22,20.26 | RL2.1 46.47,20.06 | 46.47,20.06 46.47,20.26 | RL2.14 46.47,20.57 | 46.47,20.57 46.47,20.26 | 46.22,20.26 46.22,20.31 46.47,20.57 | 46.22,20.26 46.42,20.06 46.47,20.06
DAC0_SEL  (via drill 0.35)
  Top 0.254: v53.08,15.49 v53.08,12.44 | v55.87,10.15 55.81,10.09 R13.1
  Bottom 0.254: v53.08,12.44 53.08,10.66 53.59,10.15 v55.87,10.15 | v53.08,15.49 53.08,43.68 U1.22/A8
GND  (via drill 0.35)
  Top 0.381: C8.2 v18.21,40.89 | C25.1 v30.15,32.51 | C14.2 28.32,28.06 v26.66,28.06 | C19.1 66.23,12.5 66.79,11.93 v67.56,11.93 | C9.1 10.03,31.55 v10.03,32.89
  Bottom 0.381: 74.54,11.93 74.85,11.93 | v76.19,11.93 75.18,11.93 | 75.18,11.93 74.85,11.93 | 74.85,11.93 74.85,11.68 | S1.7 74.85,11.62 | 74.85,11.62 74.85,11.68 | 75.18,11.93 74.92,11.68 74.85,11.68 | 74.85,11.62 74.54,11.93 | v67.56,11.93 74.54,11.93
  other vias: 27.55,55.62 28.31,55.62 29.08,55.62 27.55,54.73 28.31,54.73 29.08,54.73 41.65,28.57 41.65,29.33 41.65,30.09 42.54,28.57 42.54,29.33 42.54,30.09 24,17.9 24.76,17.9 25.52,17.9 1.39,18.92 1.39,19.68 1.39,20.44
  pour Top (isolate 0.305): -1.02,64.64 91.94,64.64 91.94,-1.28 -1.02,-1.28
  pour Bottom (isolate 0.305): 53.97,-0.51 -0.39,-0.51 -0.39,64.13 53.97,64.13
INTERRUPT  (via drill 0.35)
  Top 0.254: U2.25 v64,34.91
  Bottom 0.254: U1.21/A7 49.78,46.98 66.29,46.98 67.3,45.97 67.3,35.55 66.65,34.91 v64,34.91
MISO
  Top 0.254: JSPI.6 82.03,32.88 82.03,35.7 81.22,36.51 U2.11
MOSI
  Top 0.254: U2.10 80.61,35.71 81.27,35.05 81.27,32 83.05,30.22 84.68,30.22 JSPI.3
N$1
  Top 0.254: 38.6,24.51 38.6,24.76 | 38.6,24.76 38.6,26.41 38.03,26.98 R31.2 | R33.1 38.35,24.51 | 38.6,24.51 38.35,24.51 | IC7.5 37.71,21.96 38.6,22.85 38.6,24.25 | 38.6,24.25 38.6,24.51 | 38.35,24.51 38.6,24.76 | 38.35,24.51 38.6,24.25
N$2
  Top 0.254: Q2.2 49.38,29.46 54.4,29.46 | 54.4,29.46 54.6,29.46 | 54.6,29.46 54.8,29.46 | 54.8,29.46 D1.A | 54.6,29.46 54.6,29.66 | 54.6,29.66 54.6,30.47 55.11,30.98 58.67,30.98 59.17,31.49 RL1.6 | 54.6,29.66 54.8,29.46 | 54.6,29.66 54.4,29.46
N$3  (via drill 0.35)
  Top 0.254: v29.01,11.8 IC6.5 | R28.1 59.17,5.84 58.79,6.22 v58.79,9.27 | R38.1 41.27,15.62 41.65,15.23 v41.65,12.44
  Bottom 0.254: 51.93,9.52 51.93,10.79 50.92,11.8 41.9,11.8 | 51.93,9.52 51.93,9.27 | 51.93,9.27 51.93,9.01 | 51.93,9.01 R23.2 | 51.93,9.27 52.19,9.27 | v58.79,9.27 52.19,9.27 | 41.9,11.8 41.65,11.8 41.39,11.8 | 52.19,9.27 51.93,9.01 | 51.93,9.01 | 52.19,9.27 | 52.19,9.27 51.93,9.52 | v41.65,12.44 41.65,12.06 | v29.01,11.8 41.39,11.8 | 41.65,12.06 41.9,11.8 | 41.65,12.06 41.39,11.8
N$4
  Top 0.254: U2.16 72.04,42.16 | 72.04,42.16 72.04,42.54 | 72.04,42.54 72.04,42.88 | 72.04,42.88 72.04,45.94 72.7,46.6 C4.2 | Q1.1 72.38,42.54 | 72.38,42.54 72.04,42.54 | 72.04,42.88 72.38,42.54 | 72.38,42.54 72.38,42.5 72.04,42.16
N$5
  Top 0.254: 29.58,13.07 R22.2 | IC6.6 29.58,13.07 | R29.1 29.96,10.79 29.58,11.17 29.58,13.07
N$6
  Top 0.254: X1.1 8.12,17.52 8.63,18.03 R42.2
N$8  (via drill 0.35)
  Top 0.254: U2.41 72.84,25.09 v72.83,25.08 | R5.2 v87.94,9.39
  Bottom 0.254: v72.83,25.08 72.83,23.93 73.47,23.29 87.09,23.29 87.94,22.44 87.94,11.8 | S1.3 81.91,6.15 81.91,7.87 85.59,11.55 87.69,11.55 | v87.94,9.39 87.94,11.3 | 87.94,11.3 87.94,11.55 | 87.94,11.55 87.94,11.8 | 87.69,11.55 87.94,11.55 | 87.94,11.3 87.69,11.55 | 87.69,11.55 87.94,11.8
N$9  (via drill 0.35)
  Top 0.254: R32.2 R32.3 | R35.1 v15.36,12.95 | IC6.7 33.65,14.34 34.28,14.98 34.28,17.65 | R37.1 34.54,17.9 | 34.54,17.9 34.28,17.9 | 34.28,17.9 34.03,17.9 | 34.03,17.9 v33.27,17.9 | 34.28,17.65 34.28,17.9 | 34.54,17.9 34.28,17.65 | 34.28,17.65 34.03,17.9
  Bottom 0.254: v15.36,12.95 27.68,12.95 | 27.68,12.95 27.93,12.95 | 27.93,12.95 28.19,12.95 | R32.2 27.93,12.69 | 27.93,12.95 27.93,12.69 | 27.93,12.69 28.19,12.95 | 27.93,12.69 27.68,12.95 | v33.27,17.9 32.63,17.9 32.25,17.52 32.25,13.71 31.49,12.95 28.19,12.95
N$10  (via drill 0.35)
  Top 0.254: R22.1 v34.16,13.07 | v60.06,13.07 61.21,13.07 61.71,13.58 RL2.7
  Bottom 0.254: RL1.8 RL1.7 RL2.8 RL2.7 | v34.16,13.07 v60.06,13.07
N$11
  Top 0.254: R28.2 62.41,6.85 | 62.41,6.85 62.41,7.11 | R30.2 60.95,7.93 60.95,7.36 61.21,7.11 62.09,7.11 62.16,7.11 | 62.16,7.11 62.41,7.11 | 62.41,7.11 62.66,7.11 | 62.66,7.11 63.49,7.11 64.25,7.87 64.25,15.62 64.95,16.31 IC4.2 | 62.41,6.85 62.66,7.11 | 62.41,6.85 62.16,7.11
N$12
  Top 0.254: Q3.2 53.59,11.55 | 53.59,11.55 53.84,11.55 | 53.84,11.55 54.09,11.55 | 54.09,11.55 D2.A | 53.84,11.55 53.84,11.8 | 53.84,11.8 53.84,12.69 54.35,13.2 58.16,13.2 59.17,14.22 RL2.6 | 53.84,11.8 54.09,11.55 | 53.84,11.8 53.59,11.55
N$13
  Top 0.254: R25.2 65.14,5.84 64.76,6.22 64.76,8.12 | 64.76,8.12 64.76,8.38 | 64.76,8.38 64.76,8.63 | 64.76,8.63 64.76,14.6 65.2,15.04 IC4.3 | R24.1 65.02,8.38 | 64.76,8.38 65.02,8.38 | 64.76,8.63 65.02,8.38 | 65.02,8.38 64.76,8.12
N$14  (via drill 0.35)
  Top 0.254: R38.2 35.87,14.66 | 35.87,14.66 35.87,14.47 | R39.1 35.87,14.28 | 35.87,14.28 35.87,14.47 | 35.87,14.47 36.06,14.47 | v39.11,14.47 36.06,14.47 | 36.06,14.47 35.87,14.28 | 36.06,14.47 35.87,14.66 | IC4.5 v78.73,13.77
  Bottom 0.254: v39.11,14.47 39.87,13.71 78.68,13.71 v78.73,13.77
N$15
  Top 0.254: R32.1 25.39,5.2 29.46,9.27 32.25,9.27 32.69,9.71 R29.2
N$16  (via drill 0.35)
  Top 0.254: R37.2 v39.11,17.9 | R41.1 81.78,20 81.78,15.23 | v81.78,14.47 81.78,14.85 | 81.78,14.85 81.78,14.98 | 81.78,15.23 81.78,14.98 | IC4.6 81.58,15.04 | 81.58,15.04 81.72,15.04 81.78,14.98 | 81.78,15.23 81.58,15.04 | 81.58,15.04 81.77,14.85 81.78,14.85
  Bottom 0.254: v39.11,17.9 39.87,17.14 39.87,14.98 40.38,14.47 v81.78,14.47
N$17
  Top 0.254: R12.2 49.61,27.92 Q2.1
N$18
  Top 0.254: Q3.1 52.6,10.05 R13.2
N$19
  Top 0.254: IC6.1 20.19,15.62 19.88,15.92 19.88,16.98 19.59,17.27 17.01,17.27 | 17.01,17.27 16.76,17.27 | 16.76,17.27 16.5,17.27 | 16.5,17.27 13.96,17.27 13.2,18.03 R42.1 | R40.2 16.76,15.68 16.76,17.01 | 16.76,17.27 16.76,17.01 | 16.76,17.01 17.01,17.27 | 16.76,17.01 16.5,17.27
N$20
  Top 0.254: R41.2 79.11,20.31 78.73,19.93 78.73,16.76 78.28,16.31 IC4.7 76.37,16.25 74.8,16.25 74.34,16.7 74.34,19.73 74.92,20.31 D4.A
N$21
  Top 0.254: 4.75,36.19 5.01,36.19 | 5.01,36.19 IC1.2 | R11.2 2.85,36.57 3.23,36.19 4.5,36.19 | 4.5,36.19 4.75,36.19 | R10.1 4.75,35.93 | 4.75,35.93 4.75,36.19 | 4.5,36.19 4.75,35.93 | 4.75,35.93 5.01,36.19
N$22
  Top 0.254: IC6.3 20.19,13.07 19.8,12.69 19.8,10.66 19.55,10.41 18.85,10.41 R46.2
N$23
  Top 0.254: R7.1 15.04,36.44 14.78,36.19 IC1.7 IC1.6
N$24
  Top 0.254: IC2.6 35.11,35.24 | 35.11,35.24 35.3,35.24 | 35.3,35.24 35.61,35.24 | 35.61,35.24 37.08,35.24 37.33,35.49 37.33,36.44 R20.2 | R19.1 35.36,34.92 35.36,34.98 | 35.36,34.98 35.36,35.17 35.3,35.24 | 35.36,34.98 | 35.36,34.98 35.61,35.24 | 35.36,34.98 35.11,35.24
N$25  (via drill 0.35)
  Top 0.254: v72.07,25.08 72.07,26.68 U2.40 | S1.1 82.48,9.14 85.02,9.14 85.53,9.65 R4.2
  Bottom 0.254: S1.1 87.18,13.83 87.18,21.84 86.36,22.66 72.71,22.66 72.07,23.3 v72.07,25.08
N$26  (via drill 0.35)
  Top 0.254: R8.2 5.58,32.57 5.96,32.95 5.96,34.54 | R7.2 v19.55,36.44 | 5.96,34.54 5.96,34.79 | v5.96,35.55 5.96,35.05 | 5.96,35.05 5.96,34.79 | IC1.3 7.93,34.79 5.96,34.79 | 5.96,35.05 6.21,34.79 5.96,34.54
  Bottom 0.254: v5.96,35.55 5.96,36.06 6.34,36.44 v19.55,36.44
N$27
  Top 0.254: IC2.1 IC2.2 R17.1
N$28  (via drill 0.35)
  Top 0.254: R18.2 34.03,31.55 | 34.03,31.55 33.77,31.55 | 33.77,31.55 33.77,31.87 | 33.77,31.87 33.77,33.59 33.39,33.97 IC2.5 | v22.09,38.16 R17.2 | v32.63,31.55 33.46,31.55 | 33.46,31.55 33.77,31.55 | 33.77,31.87 34.03,31.62 34.03,31.55 | 33.77,31.87 33.46,31.55
  Bottom 0.254: v22.09,38.16 22.09,32.82 23.36,31.55 v32.63,31.55
N$29  (via drill 0.35)
  Top 0.254: v71.24,25.14 U2.39 | S1.5 78.18,7.32 81.59,10.73 R9.2
  Bottom 0.254: v71.24,25.14 71.24,22.89 72.11,22.02 85.81,22.02 86.54,21.29 86.54,14.03 79.83,7.32 S1.5
N$30  (via drill 0.35)
  Top 0.254: U2.32 v64,29.31 | LED1.A v82.92,15.65
  Bottom 0.254: v64,29.31 68.72,29.31 69.72,28.32 69.72,19.17 73.23,15.65 v82.92,15.65
N$31
  Top 0.254: C3.2 70.54,46.6 71.24,45.9 71.24,42.92 | 71.24,42.92 71.24,42.54 | 71.24,42.54 71.24,42.16 | 71.24,42.16 U2.17 | Q1.2 70.86,42.54 | 70.86,42.54 71.24,42.54 | 70.86,42.54 71.24,42.16 | 70.86,42.54 71.24,42.92
N$32
  Top 0.254: U2.33 64.32,28.51 64,28.19 64,23.11 64.33,22.78 R3.1
N$34
  Top 0.254: R27.1 26.15,31.04 | 26.15,31.04 26.41,31.04 | 26.41,31.04 26.66,31.04 | 26.66,31.04 C25.2 | R31.1 35.3,29.01 34.54,29.78 26.79,29.78 26.41,30.16 26.41,30.79 | 26.41,30.79 26.41,31.04 | 26.66,31.04 26.41,30.79 | 26.41,30.79 26.15,31.04
N$36
  Top 0.254: R40.1 18.72,14.6 | 18.72,14.6 18.72,14.34 | 18.72,14.34 18.72,14.09 | 18.72,14.09 R35.2 | 18.72,14.34 18.92,14.34 | 18.92,14.34 IC6.2 | 18.72,14.6 18.92,14.41 18.92,14.34 | 18.92,14.34 18.92,14.28 18.72,14.09
N$37  (via drill 0.35)
  Top 0.254: IC7.6 v35.17,23.23 | R18.1 v38.35,31.55
  Bottom 0.254: R16.2 27.8,42.1 36,42.1 36.44,41.65 36.44,31.74 | v35.17,23.23 36.06,23.23 36.44,23.62 36.44,31.36 | 36.44,31.74 36.44,31.62 | 36.44,31.62 36.44,31.36 | 36.44,31.62 36.5,31.55 36.63,31.55 | v38.35,31.55 36.63,31.55 | 36.44,31.74 36.63,31.55 | 36.63,31.55 36.44,31.36
N$38
  Top 0.254: LED1.C 86.7,15.65 86.14,16.21 R1.2
N$50
  Top 0.254: R14.2 1.77,28.06 1.39,27.68 1.39,26.03 | R15.1 1.96,23.23 1.39,23.81 1.39,25.52 | 1.39,25.52 1.39,25.77 | 1.39,25.77 1.39,26.03 | C23.2 1.39,25.77 | 1.39,26.03 1.64,25.77 1.39,25.52
N$53
  Top 0.254: C23.1 6.09,25.77 | 6.09,25.77 6.34,25.77 | 6.34,25.77 6.6,25.77 | 6.6,25.77 IC3.1 IC3.2 | 6.34,25.77 6.34,26.03 | 6.34,26.03 6.34,28.95 6.98,29.59 16.37,29.59 16.82,29.13 R21.1 | 6.34,26.03 6.6,25.77 | 6.34,26.03 6.09,25.77
N$56
  Top 0.254: R8.1 1.71,32.57 1.01,33.27 1.01,38.86 1.77,39.62 5.83,39.62 6.41,40.19 R6.2
N$58
  Top 0.254: R15.2 5.58,23.23 | 5.58,23.23 5.83,23.23 | 5.83,23.23 6.09,23.23 | 6.09,23.23 IC3.3 | 5.83,23.23 5.83,22.98 | 5.83,22.98 5.83,21.08 5.58,20.82 C22.2 | 5.58,23.23 5.83,22.98 | 5.83,22.98 6.09,23.23
N$61  (via drill 0.35)
  Top 0.254: R26.1 19.74,20.82 20.06,21.14 v20.06,22.03 | 20.06,25.9 20.06,25.65 | 20.06,25.65 v20.06,24.76 | C26.1 18.72,25.9 19.8,25.9 | 19.8,25.9 20.06,25.9 | R21.2 19.7,28.04 20.06,27.68 20.06,26.16 | 20.06,26.16 20.06,25.9 | 20.06,25.65 19.8,25.9 | 19.8,25.9 20.06,26.16
  Bottom 0.254: v20.06,24.76 v20.06,22.03
N$62
  Top 0.254: R34.1 15.49,23.23 | 15.49,23.23 15.23,23.23 | 15.23,23.23 15,23.23 | 15,23.23 IC3.6 | 15.23,24.51 15.23,24.28 | 15.23,24.28 15.23,23.49 | 15.23,23.46 15.23,23.23 | 15,24.51 15.23,24.51 | C26.2 15.69,25.85 15.23,25.39 15.23,24.73 | 15.23,24.73 15.23,24.51 | 15.23,23.49 15.49,23.23 | 15.23,23.49 15.23,23.46 | 15.23,23.46 15,23.23 | 15,24.51 15.23,24.28 | 15,24.51 15.23,24.73 | IC3.7 15,24.51
N$63
  Top 0.254: 14.98,20.82 15.23,20.82 | 15.23,20.82 R26.2 | C24.2 15.61,18.66 14.98,19.3 14.98,20.57 | 14.98,20.57 14.98,20.82 | 14.98,20.82 14.98,21.08 | 14.98,21.08 14.98,21.58 14.6,21.96 IC3.5 | 14.98,21.08 15.23,20.82 | 15.23,20.82 14.98,20.57
N$73
  Top 0.254: C28.2 21.07,28.06 20.69,27.68 20.69,26.16 | R34.2 20.19,23.23 20.69,23.74 20.69,25.65 | 20.69,26.16 20.69,25.9 | 20.69,25.9 20.69,25.65 | R36.1 20.95,25.9 | 20.95,25.9 20.69,25.9 | 20.69,26.16 20.95,25.9 | 20.95,25.9 20.69,25.65
N$75
  Top 0.254: IC7.3 25.39,23.23 | 25.39,23.23 25.14,23.23 | C27.2 24.88,23.23 | 24.88,23.23 25.14,23.23 | R36.2 23.93,24.82 24.12,24.63 24.88,24.63 25.14,24.38 25.14,23.49 | 25.14,23.49 25.14,23.23 | 24.88,23.23 25.14,23.49 | 25.14,23.49 25.39,23.23
OFF_MEASURE  (via drill 0.35)
  Top 0.254: IC4.1 71.17,17.52 v69.59,17.52 | v68.83,25.14 68.83,26.69 U2.36 | R30.1 63.49,8.38 63.75,8.63 63.75,17.01 64.25,17.52 v64.76,17.52
  Bottom 0.254: v64.76,17.52 67.05,17.52 | 67.05,17.52 67.3,17.52 | 67.3,17.52 67.56,17.52 | 67.56,17.52 v69.59,17.52 | v68.83,25.14 68.83,22.6 67.3,21.08 67.3,17.77 | 67.3,17.52 67.3,17.77 | 67.3,17.77 67.56,17.52 | 67.3,17.77 67.05,17.52
RST  (via drill 0.35)
  Top 0.254: U2.13 74.44,40.02 75.05,40.63 78.22,40.63 | R2.1 78.54,40.25 | 78.54,40.63 78.54,40.25 | 78.22,40.63 78.54,40.63 | SW1.P$2 85.75,40.63 81.4,40.63 | 78.54,40.63 78.93,40.63 | 78.93,40.63 80.64,40.63 | 80.64,40.63 81.02,40.63 | 81.02,40.63 81.4,40.63 | 78.93,40.63 78.54,40.25 | 78.54,40.25 78.22,40.57 78.22,40.63 | v81.02,39.74 81.02,40.28 | 81.02,40.63 81.02,40.28 | 81.4,40.63 81.04,40.28 81.02,40.28 | 81.02,40.28 80.99,40.28 80.64,40.63
  Bottom 0.254: JSPI.2 81.02,28.81 v81.02,39.74
RX1  (via drill 0.35)
  Top 0.254: v68.83,40.13 68.84,40.11 U2.20
  Bottom 0.254: v68.83,40.13 68.83,48.25 U1.1/TX
SCK
  Top 0.254: U2.9 80,34.91 80.5,34.4 80.5,31.86 JSPI.4
SCL  (via drill 0.35)
  Top 0.254: v70.43,40.13 70.43,38.32 U2.18 | R45.2 68.83,57.14 69.33,57.65 74.67,57.65 75.68,58.67 JDISPLAY.1
  Bottom 0.254: v70.43,40.13 70.43,48.18 67.87,50.73 67.87,56.32 69.21,57.65 74.67,57.65 75.68,58.67 JDISPLAY.1
SDA  (via drill 0.35)
  Top 0.254: U2.19 | U2.19 v69.64,40.13 | R44.1 65.78,57.65 66.41,58.29 72.51,58.29 73.14,58.92 JDISPLAY.2
  Bottom 0.254: v69.64,40.13 69.64,48.2 67.3,50.54 67.3,56.79 68.83,58.31 72.53,58.31 73.14,58.92 JDISPLAY.2
SQUARE
  Top 0.254: U1.A22/DAC1 21.07,43.68 21.07,35.62 21.46,35.24 IC2.3
SQUARE_FILTERED  (via drill 0.35)
  Top 0.254: IC7.7 33.77,24.51 | 33.77,24.51 34.03,24.51 | 34.03,24.51 34.28,24.51 | 34.28,24.51 R33.2 | 34.03,24.51 34.03,24.76 | 34.03,24.76 34.03,25.39 34.43,25.79 v37.33,25.79 | 34.28,24.51 34.03,24.76 | 34.03,24.76 33.77,24.51
  Bottom 0.254: JSQUARE_OUT.1 39.87,35.05 39.36,34.54 39.36,26.66 38.49,25.79 v37.33,25.79
SQUARE_OFFSET
  Top 0.254: 33.52,36.51 IC2.7 29.84,36.51 29.2,35.87 29.2,33.08 28.69,32.57 22.47,32.57 22.03,32.13 R27.2 | 33.52,36.51 33.77,36.51 | 33.77,36.51 34.03,36.51 | 34.03,36.51 R20.1 | 33.77,36.51 33.77,36.76 | 33.77,36.76 33.77,37.33 34.28,37.84 37.84,37.84 40.12,40.13 JSQUARE_OUT.3 | 34.03,36.51 33.77,36.76 | 33.52,36.51 33.77,36.76
SQUARE_OUT
  Top 0.254: JSQUARE_OUT.2 46.22,37.59 | 46.22,37.59 46.47,37.59 | RL1.14 46.47,37.84 | 46.47,37.84 46.47,37.59 | RL1.1 46.47,37.33 | 46.47,37.33 46.47,37.59 | 46.22,37.59 46.47,37.84 | 46.22,37.59 46.47,37.33
SQUARE_SEL  (via drill 0.35)
  Top 0.254: v56.13,27.93 56.11,27.92 R12.1
  Bottom 0.254: U1.23/A9 56.13,43.17 v56.13,27.93
TX1  (via drill 0.35)
  Top 0.254: U2.21 v68.04,40.13 | U1.0/RX 58.67,57.52 v60.44,55.75
  Bottom 0.254: v68.04,40.13 68.04,48.15 v60.44,55.75
V+  (via drill 0.35)
  Top 0.381: 33.77,39.43 33.77,39.11 | 33.77,39.11 33.77,38.09 33.46,37.78 IC2.8 | C10.1 34.16,39.43 | 33.77,39.43 34.16,39.43 | 33.77,39.43 33.77,39.74 | 33.77,39.74 v33.77,42.67 | J1.2 64.19,48.7 63.24,47.75 63.24,44.19 | 63.24,44.19 63.24,43.68 | v52.06,43.68 62.73,43.68 | 62.73,43.68 63.24,43.68 | v80,24.89 78.73,24.89 78.1,24.25 78.1,23.03 | IC7.8 33.39,25.77 33.77,26.16 33.77,27.68 33.46,28 32.5,28 | 34.16,39.43 33.84,39.11 33.77,39.11 | 34.16,39.43 33.84,39.74 33.77,39.74 | 63.24,43.68 63.24,43.17 | 63.24,43.17 63.24,29.97 62.73,29.46 D1.C | 62.73,43.68 63.24,43.17 | 62.73,43.68 63.24,44.19 | IC3.8 11.8,25.77 11.42,26.16 11.42,27.68 | C12.1 11.17,27.93 | 11.17,27.93 11.42,27.93 | 11.42,27.93 11.68,27.93 | 11.68,27.93 v12.44,27.93 | 11.42,27.93 11.42,27.68 | 11.42,27.68 11.68,27.93 | 11.42,27.68 11.17,27.93 | IC1.8 14.6,37.46 15,37.87 15,38.55 | 15,38.55 15,38.86 | 15,39.16 15,39.9 v15.03,39.92 | 15,39.16 15,38.86 | C8.1 15.31,38.86 | 15.31,38.86 15,38.86 | 15,38.55 15.31,38.86 | 15.31,38.86 15,39.16 | IC4.8 77.9,17.58 78.1,17.77 78.1,22.4 | 78.1,22.4 78.1,22.73 | 78.1,22.73 78.1,23.03 | D2.C 59.61,11.42 v61.21,11.42 | R24.2 v69.33,8.38 | IC6.8 28.82,15.62 | 28.82,15.62 29.2,15.62 | 29.2,15.62 29.58,15.62 | 29.58,15.62 C16.1 | 29.2,15.62 29.2,16 | v29.2,19.81 29.2,16 | 29.2,16 29.58,15.62 | 29.2,16 28.82,15.62 | C14.1 32.5,28 | v32.5,27.17 32.5,28 | C18.1 78.48,22.73 78.43,22.73 | 78.43,22.73 78.1,22.73 | 78.43,22.73 78.1,22.4 | 78.43,22.73 78.4,22.73 78.1,23.03
  Bottom 0.381: 69.72,0.76 88,0.76 89.65,2.41 89.65,24.51 | 69.72,0.76 69.33,0.76 | 69.33,0.76 68.98,0.76 | 68.98,0.76 61.71,0.76 | 61.21,0.76 61.71,0.76 | 61.21,0.76 60.7,0.76 | 60.7,0.76 54.73,0.76 54.47,1.01 R23.3 | 89.65,25.27 89.65,47.24 88.19,48.71 J1.2 | 89.65,25.27 89.65,24.89 | 89.65,24.89 89.65,24.51 | 3.8,43.68 3.87,43.62 3.87,43.3 | R6.3 3.87,43.3 | 24.63,43.68 24.12,43.68 | 24.63,43.68 24.5,43.55 24.5,43.3 | R16.3 24.5,43.3 | 49.01,43.68 49.01,43.3 | 49.01,43.3 RL1.13 | 24.63,43.68 24.88,43.68 | 24.88,43.68 33.39,43.68 | 33.39,43.68 33.77,43.68 | 33.77,43.68 34.16,43.68 | 34.16,43.68 48.63,43.68 | 48.63,43.68 49.01,43.68 | v33.77,42.67 33.77,43.3 | 33.77,43.3 33.77,43.68 | v52.06,43.68 51.17,43.68 | 51.17,43.68 50.79,43.68 | 50.79,43.68 50.41,43.68 | 50.41,43.68 49.39,43.68 | 49.39,43.68 49.01,43.68 | 24.12,43.68 15.49,43.68 | 15.49,43.68 14.98,43.68 | 14.98,43.68 14.47,43.68 | 14.47,43.68 4.25,43.68 | 4.25,43.68 3.8,43.68 | RL2.13 49.01,27.05 49.65,27.68 50.41,27.68 50.79,28.06 50.79,43.3 | 50.79,43.68 50.79,43.3 | v80,24.89 89.27,24.89 | 89.27,24.89 89.65,24.89 | 3.8,43.68 3.48,43.68 | 3.48,43.68 1.77,43.68 0.75,42.67 0.75,27.93 1.52,27.17 12.18,27.17 | 49.39,43.68 49.01,43.3 | 49.01,43.3 48.63,43.68 | 33.77,43.3 34.16,43.68 | 33.77,43.3 33.39,43.68 | 24.5,43.3 24.88,43.68 | 24.5,43.3 24.12,43.68 | 3.87,43.3 4.25,43.68 | 3.87,43.3 3.48,43.68 | 89.65,25.27 89.27,24.89 | 89.27,24.89 89.65,24.51 | 51.17,43.68 50.79,43.3 | 50.79,43.3 50.41,43.68 | 29.2,27.17 28.82,27.17 | 28.82,27.17 12.69,27.17 | 12.69,27.17 12.44,27.17 | v12.44,27.93 12.44,27.43 | 12.44,27.43 12.44,27.17 | 12.18,27.17 12.44,27.17 | 12.18,27.17 12.44,27.43 | 12.44,27.43 12.69,27.17 | v15.03,39.92 14.98,39.97 14.98,43.17
  Bottom 0.381: 14.98,43.17 14.98,43.68 | 14.98,43.17 15.49,43.68 | 14.47,43.68 14.98,43.17 | v61.21,11.42 61.21,1.26 | 61.21,0.76 61.21,1.26 | v69.33,8.38 69.33,1.14 | 69.33,0.76 69.33,1.14 | v29.2,19.81 29.2,26.79 | 29.2,27.17 29.2,26.79 | 29.2,27.17 29.58,27.17 | 29.58,27.17 v32.5,27.17 | 61.71,0.76 61.21,1.26 | 61.21,1.26 60.7,0.76 | 69.33,1.14 69.72,0.76 | 69.33,1.14 68.98,0.78 68.98,0.76 | 29.58,27.17 29.2,26.79 | 29.2,26.79 28.82,27.17
V-  (via drill 0.35)
  Top 0.381: J1.1 88.26,45.21 89.65,43.81 89.65,2.41 87.78,0.54 71.08,0.54 | 8.88,42.92 8.56,42.92 | 8.56,42.92 1.77,42.92 0.56,41.71 0.56,31.87 | 8.88,42.92 9.33,42.92 | 8.88,42.92 8.95,42.86 8.95,42.54 | R6.1 8.95,42.54 | C9.2 6.85,31.49 | 6.85,31.49 6.47,31.49 | IC1.4 6.72,33.65 6.47,33.4 6.47,31.87 | IC3.4 6.72,21.96 6.28,21.52 6.28,19.93 | IC2.4 26.79,34.03 26.73,33.97 25.39,33.97 | 8.95,42.54 9.33,42.92 | 8.95,42.54 8.56,42.92 | 6.28,19.93 6.28,19.42 | 6.28,19.42 6.28,19.11 | 6.28,18.66 6.28,19.04 | C13.2 5.9,18.66 | 6.28,18.66 5.9,18.66 | 6.47,31.49 6.09,31.49 | 6.47,31.49 6.47,31.87 | 6.47,31.87 6.85,31.49 | 6.47,31.87 6.09,31.49 | 6.28,18.66 6.28,18.28 | 6.28,18.28 6.28,17.71 5.33,16.76 1.01,16.76 | v7.99,19.55 6.72,19.55 | 6.72,19.55 6.41,19.55 6.28,19.42 | 6.28,19.11 6.28,19.04 | 6.28,19.11 6.72,19.55 | 6.72,19.55 6.34,19.93 6.28,19.93 | 6.28,19.04 5.9,18.66 | 5.9,18.66 6.28,18.28 | IC7.4 25.52,21.96 25.14,21.58 25.14,21.08 | 25.14,21.08 25.14,20.82 | C15.2 24.88,20.82 | 25.14,20.82 24.88,20.82 | 25.14,20.57 25.14,20.82 | 24.88,20.82 25.14,21.08 | 24.88,20.82 25.14,20.57 | 49.01,0.54 20.79,0.54 | 20.79,0.54 20.31,0.54 | 20.31,0.54 19.84,0.54 | 19.84,0.54 2.62,0.54 0.56,2.6 0.56,16.38 | C11.2 24.88,33.97 | 24.88,33.97 25.14,33.97 | 25.14,33.97 25.39,33.97 | v25.14,33.09 25.14,33.71 | 25.14,33.71 25.14,33.97 | 25.39,33.97 25.14,33.71 | 25.14,33.71 24.88,33.97 | 49.01,0.54 49.27,0.54 | 49.27,0.54 49.78,0.54 | R23.1 49.39,0.92 | 49.39,0.92 49.39,0.66 49.27,0.54 | 49.39,0.92 49.78,0.54 | 49.39,0.92 | 49.39,0.92 49.01,0.54 | 49.78,0.54 70.15,0.54 | 70.15,0.54 70.6,0.54 | 70.6,0.54 71.08,0.54 | C19.2 68.18,13.77 69.72,13.77 | 69.72,13.77 IC4.4 | 69.72,13.77 69.72,10.03 70.6,9.14 70.6,6.22
  Top 0.381: 70.6,6.22 70.6,5.84 | 70.6,5.84 70.6,5.45 | 70.6,5.45 70.6,1.01 | 70.6,0.99 70.6,0.54 | R25.1 70.22,5.84 | 70.22,5.84 70.6,5.84 | IC6.4 20.69,11.8 20.31,11.42 20.31,8.43 | 20.31,8.43 20.31,8.12 | C17.2 19.93,8.12 | 20.31,8.12 19.93,8.12 | 20.31,8.12 20.31,7.74 | 20.31,7.74 20.31,1.01 | 20.31,1.01 20.31,0.54 | 20.31,1.01 20.79,0.54 | 20.31,1.01 19.84,0.54 | v23.87,19.55 24.63,19.55 25.14,20.06 25.14,20.57 | 0.56,31.87 0.56,31.49 | 0.56,31.49 0.56,31.11 | 0.56,31.11 0.56,17.14 | 0.56,17.14 0.56,16.76 | 0.56,16.76 0.56,16.38 | 6.09,31.49 1.01,31.49 | 0.56,31.49 1.01,31.49 | 0.56,16.76 1.01,16.76 | 70.22,5.84 70.6,6.22 | 70.22,5.84 70.6,5.45 | 70.6,1.01 71.08,0.54 | 70.6,1.01 70.6,0.99 | 70.6,0.99 70.15,0.54 | 1.01,16.76 0.63,16.38 0.56,16.38 | 1.01,16.76 0.63,17.14 0.56,17.14 | 19.93,8.12 20.24,8.43 20.31,8.43 | 19.93,8.12 20.31,7.74 | 1.01,31.49 0.63,31.11 0.56,31.11 | 1.01,31.49 0.63,31.87 0.56,31.87 | 9.33,42.92 v18.28,42.92
  Bottom 0.381: v25.14,33.09 28.77,33.09 29.58,33.9 29.58,39.74 | 29.58,39.74 29.58,40.13 | 29.58,40.13 29.58,40.51 | 29.58,40.51 R16.1 | 29.2,40.13 22.85,40.13 20.06,42.92 v18.28,42.92 | 29.58,40.13 29.2,40.13 | 29.2,40.13 29.58,40.51 | 29.2,40.13 29.58,39.74 | v7.99,19.55 v23.87,19.55
(copper drawn outside any net)
  shapes: Top area x2

### Text on the board
tNames: GND | +5V | +12V | -12V | OFFSET | FILTERED | vcc | OFFSET | FILTERED
bNames: Teensy 3.5 DDS Signal Generator by EmaMaker - https://github.com/EmaMaker/SignalGenerator-Teensy
_bsilk: JLCJLCJLCJLC